# Altium project power_board.PrjPcb (part 2 of 2)
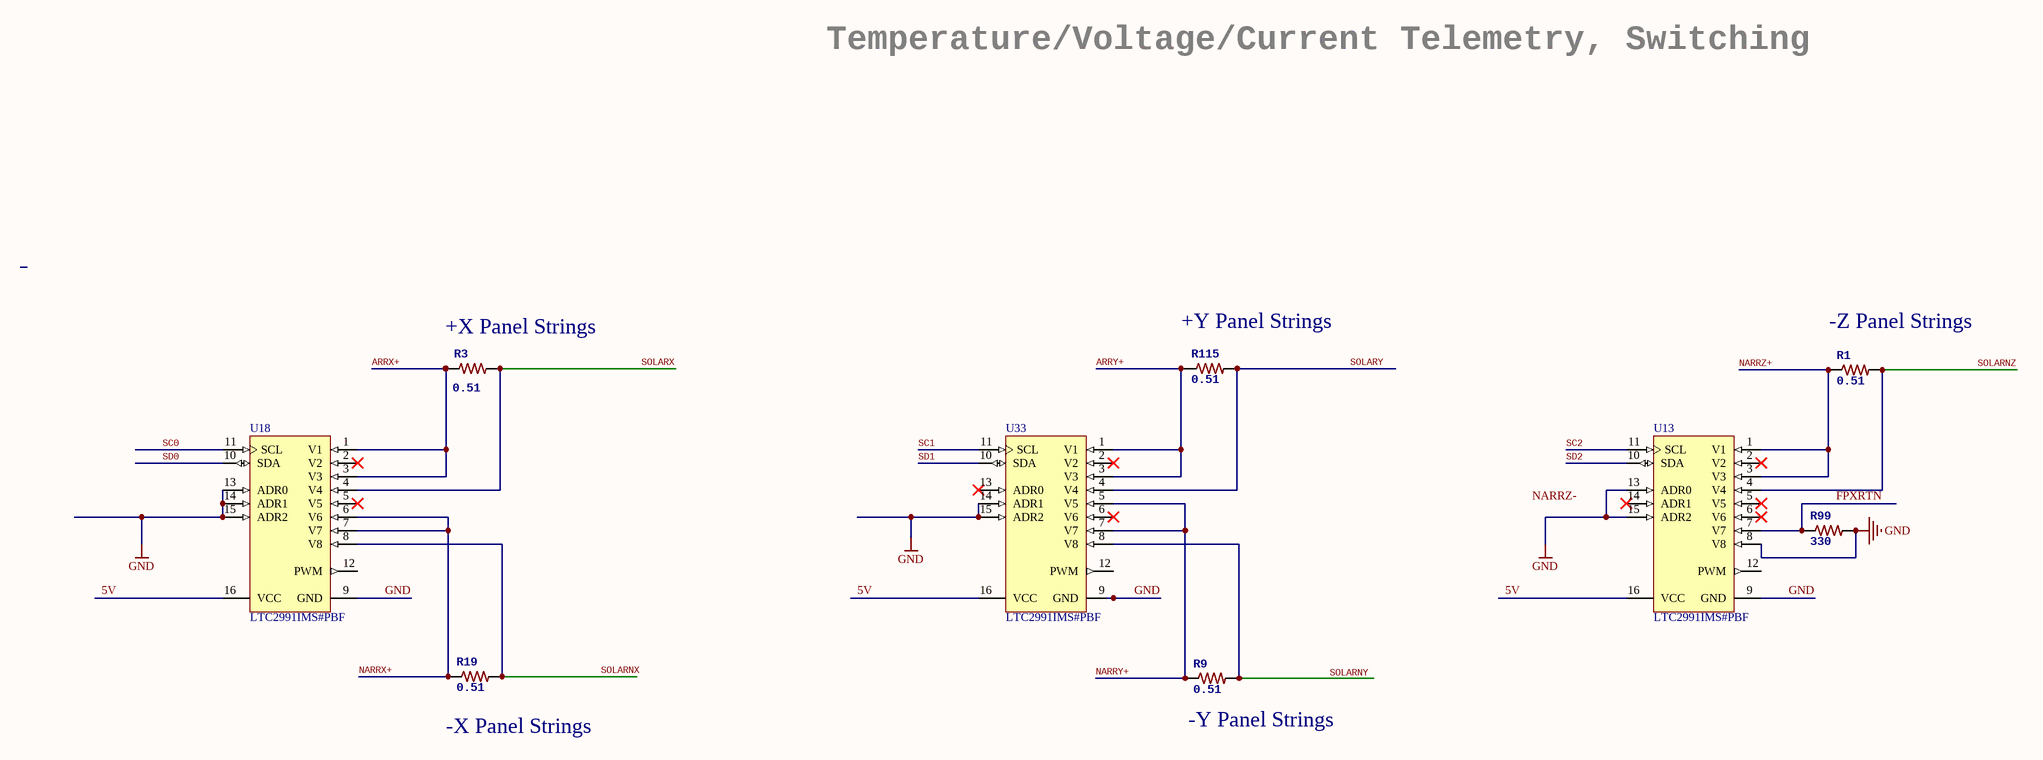
[diagram p5: MPPT_Measurements.SchDoc]

## Nets that join several sheets
3V3: power_board_2.SchDoc (H1.48 H1.50 H1.52 J3.4), power_board_uC (25 pins), BCR (16 pins)
5V: power_board_2.SchDoc (H1.1 H2.25 H2.26 P.2), BCR (16 pins), MPPT_Measurements (U13.16 U18.16 U33.16)
ACS_5V: power_board_2.SchDoc (H2.27 H2.28), BCR (Q86.2)
ANTENNA: power_board_2.SchDoc (P.1), BCR (Q88.2)
ARRAYNX.4.NEG.NEG: power_board_2.SchDoc (14 pins), power_board_uC (8 pins), MPPT-BCR (85 pins), BCR (59 pins), MPPT_Measurements (12 pins)
FIPEX_3.3V: power_board_2.SchDoc (H1.42), BCR (Q77.2)
FIPEX_5V: power_board_2.SchDoc (H1.45), BCR (Q87.2)
PTT: power_board_2.SchDoc (H1.44 H1.46), BCR (Q78.2)
ACS3.3V: power_board_2.SchDoc (H1.27 H1.28), BCR (Q76.2)
ARRAYNX.1.POS.POS: power_board_2.SchDoc (P2.1 P2.2), MPPT_Measurements (R19.1 U18.6 U18.7)
ARRAYNX.7.SDA.SDA: power_board_2.SchDoc (P1.7 P1.8 P2.7), power_board_uC (R102.2 U2.4), MPPT_Measurements (U18.10)
ARRAYNX.10.SCL.SCL: power_board_2.SchDoc (P1.9 P1.10 P2.9 P2.10), power_board_uC (R103.2 U2.5), MPPT_Measurements (U18.11)
ARRAYNY.2.POS.POS: power_board_2.SchDoc (P4.1 P4.2), MPPT_Measurements (R9.1 U33.5 U33.7)
ARRAYNY.7.SDA.SDA: power_board_2.SchDoc (P3.7 P3.8 P4.7 P4.8), power_board_uC (R112.2 U2.6), MPPT_Measurements (U33.10)
ARRAYNY.10.SCL.SCL: power_board_2.SchDoc (P3.9 P3.10 P4.9 P4.10), power_board_uC (R113.2 U2.7), MPPT_Measurements (U33.11)
ARRAYNZ.1.POS.POS: power_board_2.SchDoc (P5.1), MPPT_Measurements (R1.1 U13.1 U13.3)
ARRAYNZ.7.SDA.SDA: power_board_2.SchDoc (P5.7), power_board_uC (R122.2 U2.8), MPPT_Measurements (U13.10)
ARRAYNZ.8.NC.NC: power_board_2.SchDoc (H2.21 H2.45 H2.46 P5.8), BCR (5 pins)
ARRAYNZ.9.SCL.SCL: power_board_2.SchDoc (P5.9), power_board_uC (R123.2 U2.9), MPPT_Measurements (U13.11)
ARRAYNZ.10.COM.COM: power_board_2.SchDoc (P5.10), BCR (10 pins)
ARRAYX.1.POS.POS: power_board_2.SchDoc (P1.1 P1.2), MPPT_Measurements (R3.1 U18.1 U18.3)
ARRAYY.1.POS.POS: power_board_2.SchDoc (P3.1 P3.2), MPPT_Measurements (R115.1 U33.1 U33.3)
DSR MHX: power_board_2.SchDoc (H1.37), power_board_uC (R104.1 U1.20)
FPXRTN: power_board_2.SchDoc (P.4), MPPT_Measurements (R99.1 U13.7)
IO4: power_board_2.SchDoc (H1.20), power_board_uC (U1.41)
IO5: power_board_2.SchDoc (H1.19), power_board_uC (U1.42)
RST: power_board_2.SchDoc (J3.1), power_board_uC (U1.2)
SC3: power_board_uC (R133.2 U2.11), BCR (U74.6 U75.6)
SC5: power_board_uC (R152.2 U2.16), BCR (U83.6 U84.6 U85.6)
SD3: power_board_uC (R132.2 U2.10), BCR (U73.7 U74.7 U75.7)
SD5: power_board_uC (R153.2 U2.15), BCR (U84.7 U85.7)
SOLARNX: MPPT-BCR (Cin2.1 Lx2.1 R23.2), MPPT_Measurements (R19.2 U18.8)
SOLARNZ: MPPT-BCR (Cin5.1 Lx5.1 R53.2), MPPT_Measurements (R1.2 U13.4)
SOLARX: MPPT-BCR (Cin1.1 Lx1.1 R13.2), MPPT_Measurements (R3.2 U18.4)
SOLARY: MPPT-BCR (Cin3.1 Lx3.1 R33.2), MPPT_Measurements (R115.2 U33.4)
ST1NX: power_board_uC (U1.14), MPPT-BCR (U22.4)
ST1X: power_board_uC (U1.7), MPPT-BCR (U12.4)
ST1Y: power_board_uC (U1.16), MPPT-BCR (U32.4)
ST2NX: power_board_uC (U1.15), MPPT-BCR (U22.3)
ST2X: power_board_uC (U1.8), MPPT-BCR (U12.3)
ST2Y: power_board_uC (U1.17), MPPT-BCR (U32.3)
STLINK-SWIM: power_board_2.SchDoc (J3.3), power_board_uC (U1.1)
Vchrg: MPPT-BCR (15 pins), BCR (U70.7 U70.8)